# Altium project UJ47SY_Hazi.PrjPcb
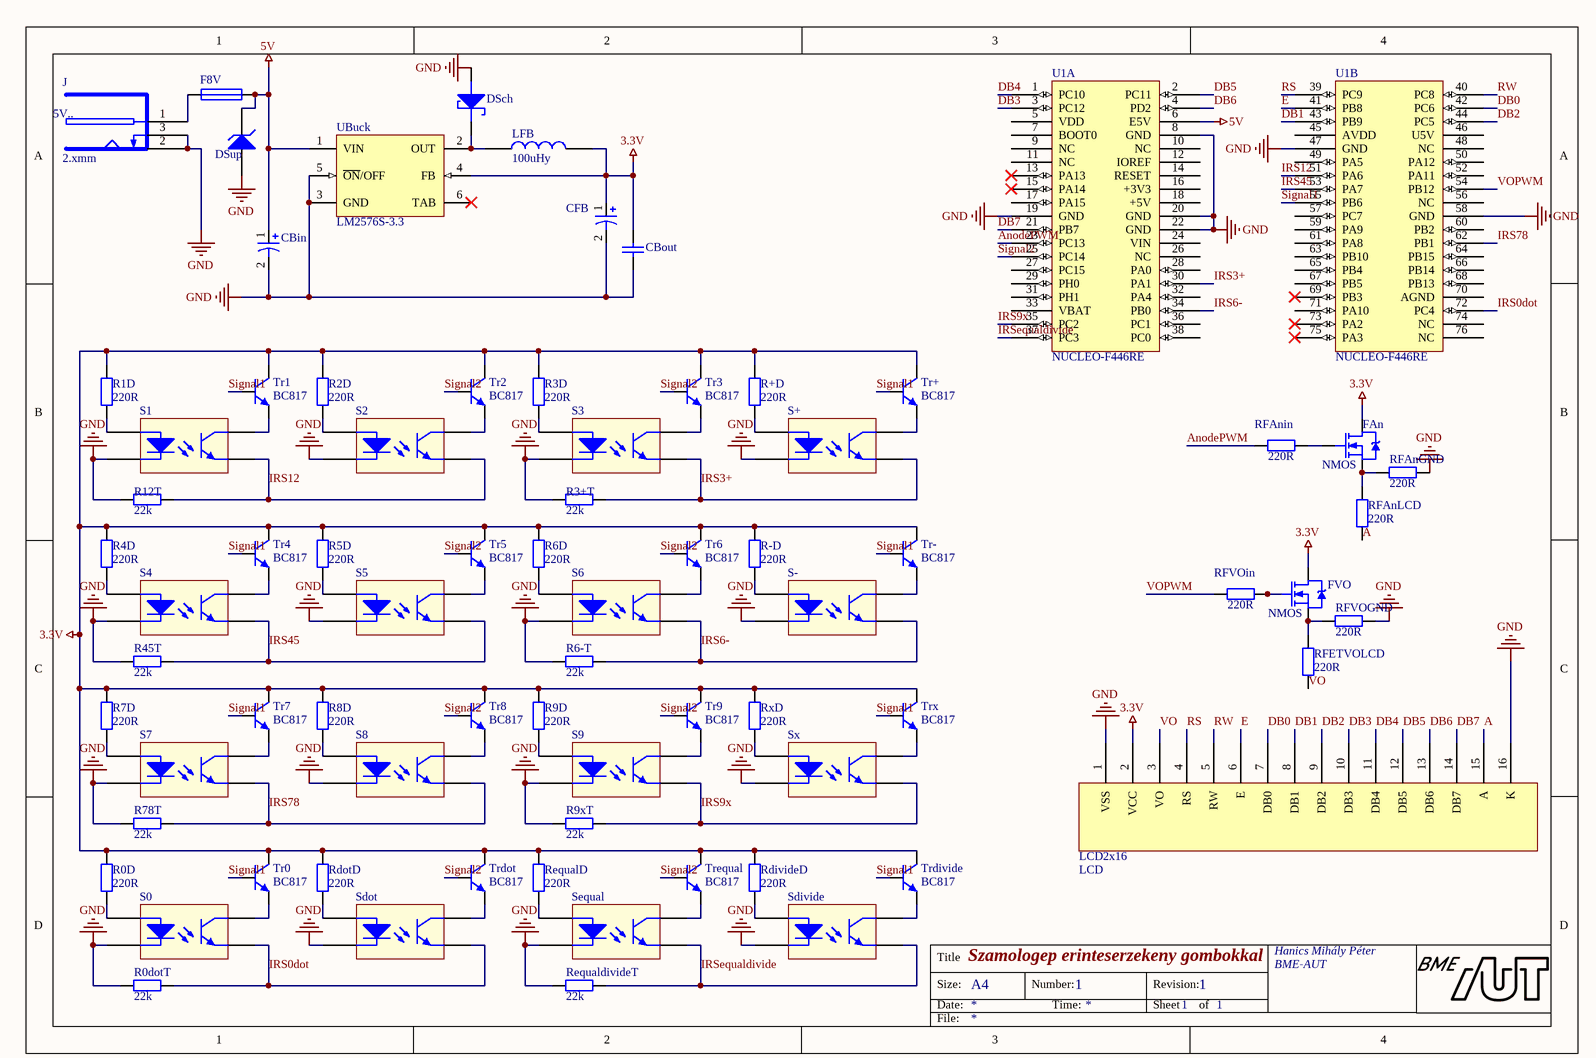
[diagram p0: Nucleo.SchDoc]
1 sheet, 75 parts. Net scope: global (net labels, ports and power ports of the same name join across sheets).
Board file: hazi_kiindulas.PcbDoc

## Sheet Nucleo.SchDoc: Szamologep erinteserzekeny gombokkal
size A4; Author: Hanics Mihály Péter; Organization: BME-AUT; DocumentNumber: 1; Revision: 1; SheetNumber: 1; SheetTotal: 1

### Parts
CBin  100uF  [CAP_100uF_ELKO]  (value not drawn)
CBout  100nF  [FP_0805_CAP_085]  (value not drawn)
CFB  1000uF  [CAP_Elko1000uF]  (value not drawn)
DSch  SCHOTTKY  [FP_SOD323-F]  (value not drawn)
DSup  (no value)  [DiodeSMAJ5A]
F8V  Fuse  [FP_MULTIFUSE]  (value not drawn)
FAn  NMOS  [FP_SOT223]
FVO  NMOS  [FP_SOT223]
J  2.xmm  [FP_DC_TAP_ANYA]
LCD2x16  LCD  [FP_LCD2X16curr]
LFB  100uHy  [IND100uHy]
R0D  220R  [FP_0805_RES]
R0dotT  22k  [FP_0805_RES]
R1D  220R  [FP_0805_RES]
R2D  220R  [FP_0805_RES]
R3+T  22k  [FP_0805_RES]
R3D  220R  [FP_0805_RES]
R4D  220R  [FP_0805_RES]
R5D  220R  [FP_0805_RES]
R6-T  22k  [FP_0805_RES]
R6D  220R  [FP_0805_RES]
R7D  220R  [FP_0805_RES]
R8D  220R  [FP_0805_RES]
R9D  220R  [FP_0805_RES]
R9xT  22k  [FP_0805_RES]
R12T  22k  [FP_0805_RES]
R45T  22k  [FP_0805_RES]
R78T  22k  [FP_0805_RES]
R+D  220R  [FP_0805_RES]
R-D  220R  [FP_0805_RES]
RdivideD  220R  [FP_0805_RES]
RdotD  220R  [FP_0805_RES]
RequalD  220R  [FP_0805_RES]
RequaldivideT  22k  [FP_0805_RES]
RFAnGND  220R  [FP_0805_RES]
RFAnin  220R  [FP_0805_RES]
RFAnLCD  220R  [FP_0805_RES]
RFETVOLCD  220R  [FP_0805_RES]
RFVOGND  220R  [FP_0805_RES]
RFVOin  220R  [FP_0805_RES]
RxD  220R  [FP_0805_RES]
S0  CNY70  [CNY70]  (value not drawn)
S1  CNY70  [CNY70]  (value not drawn)
S2  CNY70  [CNY70]  (value not drawn)
S3  CNY70  [CNY70]  (value not drawn)
S4  CNY70  [CNY70]  (value not drawn)
S5  CNY70  [CNY70]  (value not drawn)
S6  CNY70  [CNY70]  (value not drawn)
S7  CNY70  [CNY70]  (value not drawn)
S8  CNY70  [CNY70]  (value not drawn)
S9  CNY70  [CNY70]  (value not drawn)
S+  CNY70  [CNY70]  (value not drawn)
S-  CNY70  [CNY70]  (value not drawn)
Sdivide  CNY70  [CNY70]  (value not drawn)
Sdot  CNY70  [CNY70]  (value not drawn)
Sequal  CNY70  [CNY70]  (value not drawn)
Sx  CNY70  [CNY70]  (value not drawn)
Tr0  BC817  [FP_SOT23-3]
Tr1  BC817  [FP_SOT23-3]
Tr2  BC817  [FP_SOT23-3]
Tr3  BC817  [FP_SOT23-3]
Tr4  BC817  [FP_SOT23-3]
Tr5  BC817  [FP_SOT23-3]
Tr6  BC817  [FP_SOT23-3]
Tr7  BC817  [FP_SOT23-3]
Tr8  BC817  [FP_SOT23-3]
Tr9  BC817  [FP_SOT23-3]
Tr+  BC817  [FP_SOT23-3]
Tr-  BC817  [FP_SOT23-3]
Trdivide  BC817  [FP_SOT23-3]
Trdot  BC817  [FP_SOT23-3]
Trequal  BC817  [FP_SOT23-3]
Trx  BC817  [FP_SOT23-3]
U1  NUCLEO-F446RE  [FP_NUCLEO-64]  (parts A,B of 2)
UBuck  LM2576S-3.3  [TS5B_M]

### Nets
3.3V: CBout.2 CFB.1 FAn.2(D) FVO.2(D) LCD2x16.2(VCC) LFB.2 R0D.1 R1D.2 R2D.1 R3D.1 R4D.1 R5D.1 R6D.1 R7D.1 R8D.1 R9D.1 R+D.1 R-D.1 RdivideD.1 RdotD.1 RequalD.1 RxD.1 Tr0.3(C) Tr1.3(C) Tr2.3(C) Tr3.3(C) Tr4.3(C) Tr5.3(C) Tr6.3(C) Tr7.3(C) Tr8.3(C) Tr9.3(C) Tr+.3(C) Tr-.3(C) Trdivide.3(C) Trdot.3(C) Trequal.3(C) Trx.3(C) UBuck.4(FB)
5V: CBin.1 DSup.1(K) F8V.2 U1.6(E5V) UBuck.1(VIN)
GND: CBin.2 CBout.1 CFB.2 DSch.1(ANODE) DSup.2(A) J.2(SLEEVE) J.3(BREAK) LCD2x16.1(VSS) LCD2x16.16(K) R0dotT.1 R3+T.2 R6-T.2 R9xT.2 R12T.2 R45T.1 R78T.2 RequaldivideT.2 RFAnGND.1 RFVOGND.1 S0.2(K) S1.2(K) S2.2(K) S3.2(K) S4.2(K) S5.2(K) S6.2(K) S7.2(K) S8.2(K) S9.2(K) S+.2(K) S-.2(K) Sdivide.2(K) Sdot.2(K) Sequal.2(K) Sx.2(K) U1.8(GND) U1.19(GND) U1.20(GND) U1.22(GND) U1.47(GND) U1.58(GND) UBuck.3(GND) UBuck.5(~{ON}/OFF)
A: LCD2x16.15(A) RFAnLCD.2
AnodePWM: RFAnin.2 U1.23(PC13)
DB0: LCD2x16.7(DB0) U1.42(PC6)
DB1: LCD2x16.8(DB1) U1.43(PB9)
DB2: LCD2x16.9(DB2) U1.44(PC5)
DB3: LCD2x16.10(DB3) U1.3(PC12)
DB4: LCD2x16.11(DB4) U1.1(PC10)
DB5: LCD2x16.12(DB5) U1.2(PC11)
DB6: LCD2x16.13(DB6) U1.4(PD2)
DB7: LCD2x16.14(DB7) U1.21(PB7)
E: LCD2x16.6(E) U1.41(PB8)
IRS0dot: R0dotT.2 S0.4(E) Sdot.4(E) U1.72(PC4)
IRS3+: R3+T.1 S3.4(E) S+.4(E) U1.30(PA1)
IRS6-: R6-T.1 S6.4(E) S-.4(E) U1.34(PB0)
IRS9x: R9xT.1 S9.4(E) Sx.4(E) U1.35(PC2)
IRS12: R12T.1 S1.4(E) S2.4(E) U1.51(PA6)
IRS45: R45T.2 S4.4(E) S5.4(E) U1.53(PA7)
IRS78: R78T.1 S7.4(E) S8.4(E) U1.62(PB1)
IRSequaldivide: RequaldivideT.1 Sdivide.4(E) Sequal.4(E) U1.37(PC3)
RS: LCD2x16.4(RS) U1.39(PC9)
RW: LCD2x16.5(RW) U1.40(PC8)
Signal1: Tr0.1(B) Tr1.1(B) Tr4.1(B) Tr7.1(B) Tr+.1(B) Tr-.1(B) Trdivide.1(B) Trx.1(B) U1.55(PB6)
Signal2: Tr2.1(B) Tr3.1(B) Tr5.1(B) Tr6.1(B) Tr8.1(B) Tr9.1(B) Trdot.1(B) Trequal.1(B) U1.25(PC14)
VO: LCD2x16.3(VO) RFETVOLCD.2
VOPWM: RFVOin.2 U1.54(PB12)
NetDSch_2: DSch.2(CATHODE) LFB.1 UBuck.2(OUT)
NetF8V_1: F8V.1 J.1(PIN)
NetFAn_1: FAn.1(G) RFAnin.1
NetFAn_3: FAn.3(S) RFAnGND.2 RFAnLCD.1
NetFVO_1: FVO.1(G) RFVOin.1
NetFVO_3: FVO.3(S) RFETVOLCD.1 RFVOGND.2
NetR0D_2: R0D.2 S0.1(A)
NetR1D_1: R1D.1 S1.1(A)
NetR2D_2: R2D.2 S2.1(A)
NetR3D_2: R3D.2 S3.1(A)
NetR4D_2: R4D.2 S4.1(A)
NetR5D_2: R5D.2 S5.1(A)
NetR6D_2: R6D.2 S6.1(A)
NetR7D_2: R7D.2 S7.1(A)
NetR8D_2: R8D.2 S8.1(A)
NetR9D_2: R9D.2 S9.1(A)
NetR+D_2: R+D.2 S+.1(A)
NetR-D_2: R-D.2 S-.1(A)
NetRdivideD_2: RdivideD.2 Sdivide.1(A)
NetRdotD_2: RdotD.2 Sdot.1(A)
NetRequalD_2: RequalD.2 Sequal.1(A)
NetRxD_2: RxD.2 Sx.1(A)
NetS0_3: S0.3(C) Tr0.2(E)
NetS1_3: S1.3(C) Tr1.2(E)
NetS2_3: S2.3(C) Tr2.2(E)
NetS3_3: S3.3(C) Tr3.2(E)
NetS4_3: S4.3(C) Tr4.2(E)
NetS5_3: S5.3(C) Tr5.2(E)
NetS6_3: S6.3(C) Tr6.2(E)
NetS7_3: S7.3(C) Tr7.2(E)
NetS8_3: S8.3(C) Tr8.2(E)
NetS9_3: S9.3(C) Tr9.2(E)
NetS+_3: S+.3(C) Tr+.2(E)
NetS-_3: S-.3(C) Tr-.2(E)
NetSdivide_3: Sdivide.3(C) Trdivide.2(E)
NetSdot_3: Sdot.3(C) Trdot.2(E)
NetSequal_3: Sequal.3(C) Trequal.2(E)
NetSx_3: Sx.3(C) Trx.2(E)

Not connected (* = marked no-connect by the designer): U1 5(VDD) 7(BOOT0) 9(NC) 10(NC) 11(NC) 12(IOREF) 13(PA13)* 14(RESET) 15(PA14)* 16(+3V3) 17(PA15) 18(+5V) 24(VIN) 26(NC) 27(PC15) 28(PA0) 29(PH0) 31(PH1) 32(PA4) 33(VBAT) 36(PC1) 38(PC0) 45(AVDD) 46(U5V) 48(NC) 49(PA5) 50(PA12) 52(PA11) 56(NC) 57(PC7) 59(PA9) 60(PB2) 61(PA8) 63(PB10) 64(PB15) 65(PB4) 66(PB14) 67(PB5) 68(PB13) 69(PB3)* 70(AGND) 71(PA10) 73(PA2)* 74(NC) 75(PA3)* 76(NC); UBuck 6(TAB)*

### Notes on the sheet
- 5V..
- Title
- Size:
- Date:
- A4
- Number:
- Time:
- Revision:
- Sheet
- of
- File:

### Library data of the parts
CBin = CAP100uF: 100uF Capacitor; Tolerance: 20%; Voltage: 16V; Name: Electrolytic capacitor; Supplier: Lomex; Reference: 91-00-20; Value: 100uF
CBout = CAP: Capacitor; Tolerance: 10%; Voltage: 50V; Name: Capacitor 100nF; Supplier: Lomex; Reference: 82-13-46; Value: 100nF
CFB = CAP1000uF: 1000uF Capacitor; Tolerance: 20%; Voltage: 6.3V; Name: Electrolytic Capacitor; Supplier: Lomex; Reference: 91-01-03; Value: 1000uF
DSch = SCHOTTKY: Schottky diode; Name: Catch Diode (Schottky); Supplier: Lomex; Reference: 83-01-41
DSup = SMAJ5A: Suppressor Diode; V_R: 5; Supplier: Lomex; Reference: 96-00-75; Name: SMAJ5A
F8V = Fuse: Name: Polyfuse 8V 2.6A SMD 1812; Reference: 44-04-73; Supplier: Lomex
FAn FVO = NMOS: NXP - BSP030,115 - MOSFET, N CH, 30V, 10A, SOT223; Name: BSP89 NMOS 240V 0.35A Small Signal FET; Supplier: Lomex; Reference: 86-01-40
J = DC_TAP_ANYA: 2.xmm DC HEBA25 TÁPFESZÜLTSÉG ALJZAT ZÁRT, NYÁKBA 90°; Name: TÁP DC ANYA 5.5/2.1/9.5mm DCS-5521-5; Supplier: Lomex; Reference: 43-07-67
LCD2x16 = LCD1602: 16x2 LCD; Reference: BUY030; Name: ERM1602SBS-6 _ 3.3V; Supplier: ChipCAD
LFB = IND100uH: 100uH Inductor; Imax: 0.52A; Tolerance: 10%; Name: Power Inductor; Supplier: Lomex; Reference: 93-02-83; Value: 100uHy
R0D R1D R2D R3D R4D R5D R6D R7D R8D R9D R+D R-D RdivideD RdotD RequalD RFAnGND RFAnin RFAnLCD RFETVOLCD RFVOGND RFVOin RxD = RES: Resistor; Tolerance: 1%; Power: 0.125W; Name: CR-05FL7--220R; Supplier: Lomex; Reference: 80-10-78; Value: 220R
R0dotT R3+T R6-T R9xT R12T R45T R78T RequaldivideT = RES: Resistor; Tolerance: 1%; Power: 0.125W; Name: CR-05FL7---22k; Supplier: Lomex; Reference: 80-11-02; Value: 22k
S0-S9 S+ S- Sdivide Sdot Sequal Sx = CNY70: Reflective Optical Sensor; pin to pad: 1>A 2>K 3>C 4>E; Supplier: Lomex; Reference: 38-00-43; Name: CNY70
Tr0-Tr9 Tr+ Tr- Trdivide Trdot Trequal Trx = BC817: NPN General-purpose Transistor; Name: BJT; ComponentLink1Description: Manufacturer Link; ComponentLink1URL: http://www.semiconductors.philips.com/; ComponentLink2Description: Datasheet; ComponentLink2URL: http://www.semiconductors.philips.com/acrobat/datasheets/BC817_BC817W_BC337_5.pdf; Supplier: Lomex; Reference: 86-01-94
U1 = NUCLEO-F446RE: Reference: NUCLEO; Name: Nucleo F446RE; Supplier: Tanszék
UBuck = CMP-0069-00113-2: SIMPLE SWITCHER® 3A Step-Down Voltage Regulator, 5-pin TO-263; Manufacturer: National Semiconductor; PackageTopMarking: NSUZXYTTE#*LM2576S*-3.3 P+; PowerWise: N; Name: Step down regulator; ComponentLink2URL: http://www.national.com/pf/LM/LM2576.html; ComponentLink1URL: http://www.national.com/ds/LM/LM2576.pdf; Code_JEDEC: MO-169-AB; RoHS: N; ComponentLink3Description: TS5B Package Page; PackageReference: TS5B; CompType: Switcher; RevisionNote: Component URLs added; DatasheetVersion: Aug-2004; ComponentLink2Description: LM2576 Web Page; ComponentLink1Description: LM2576 Datasheet; PackageDescription: TO-263, Molded, .400 x .390 x .180in, 5 Lead, .067in Pitch, Surface Mount; ComponentLink3URL: http://www.national.com/packaging/folders/ts5b.html; PackageVersion: revD, Apr-2005; PinCount: 5; Reference: 89-21-81; Supplier: Lomex